# EAGLE design GeneralIOMiniRev3 (EAGLE 4.13)
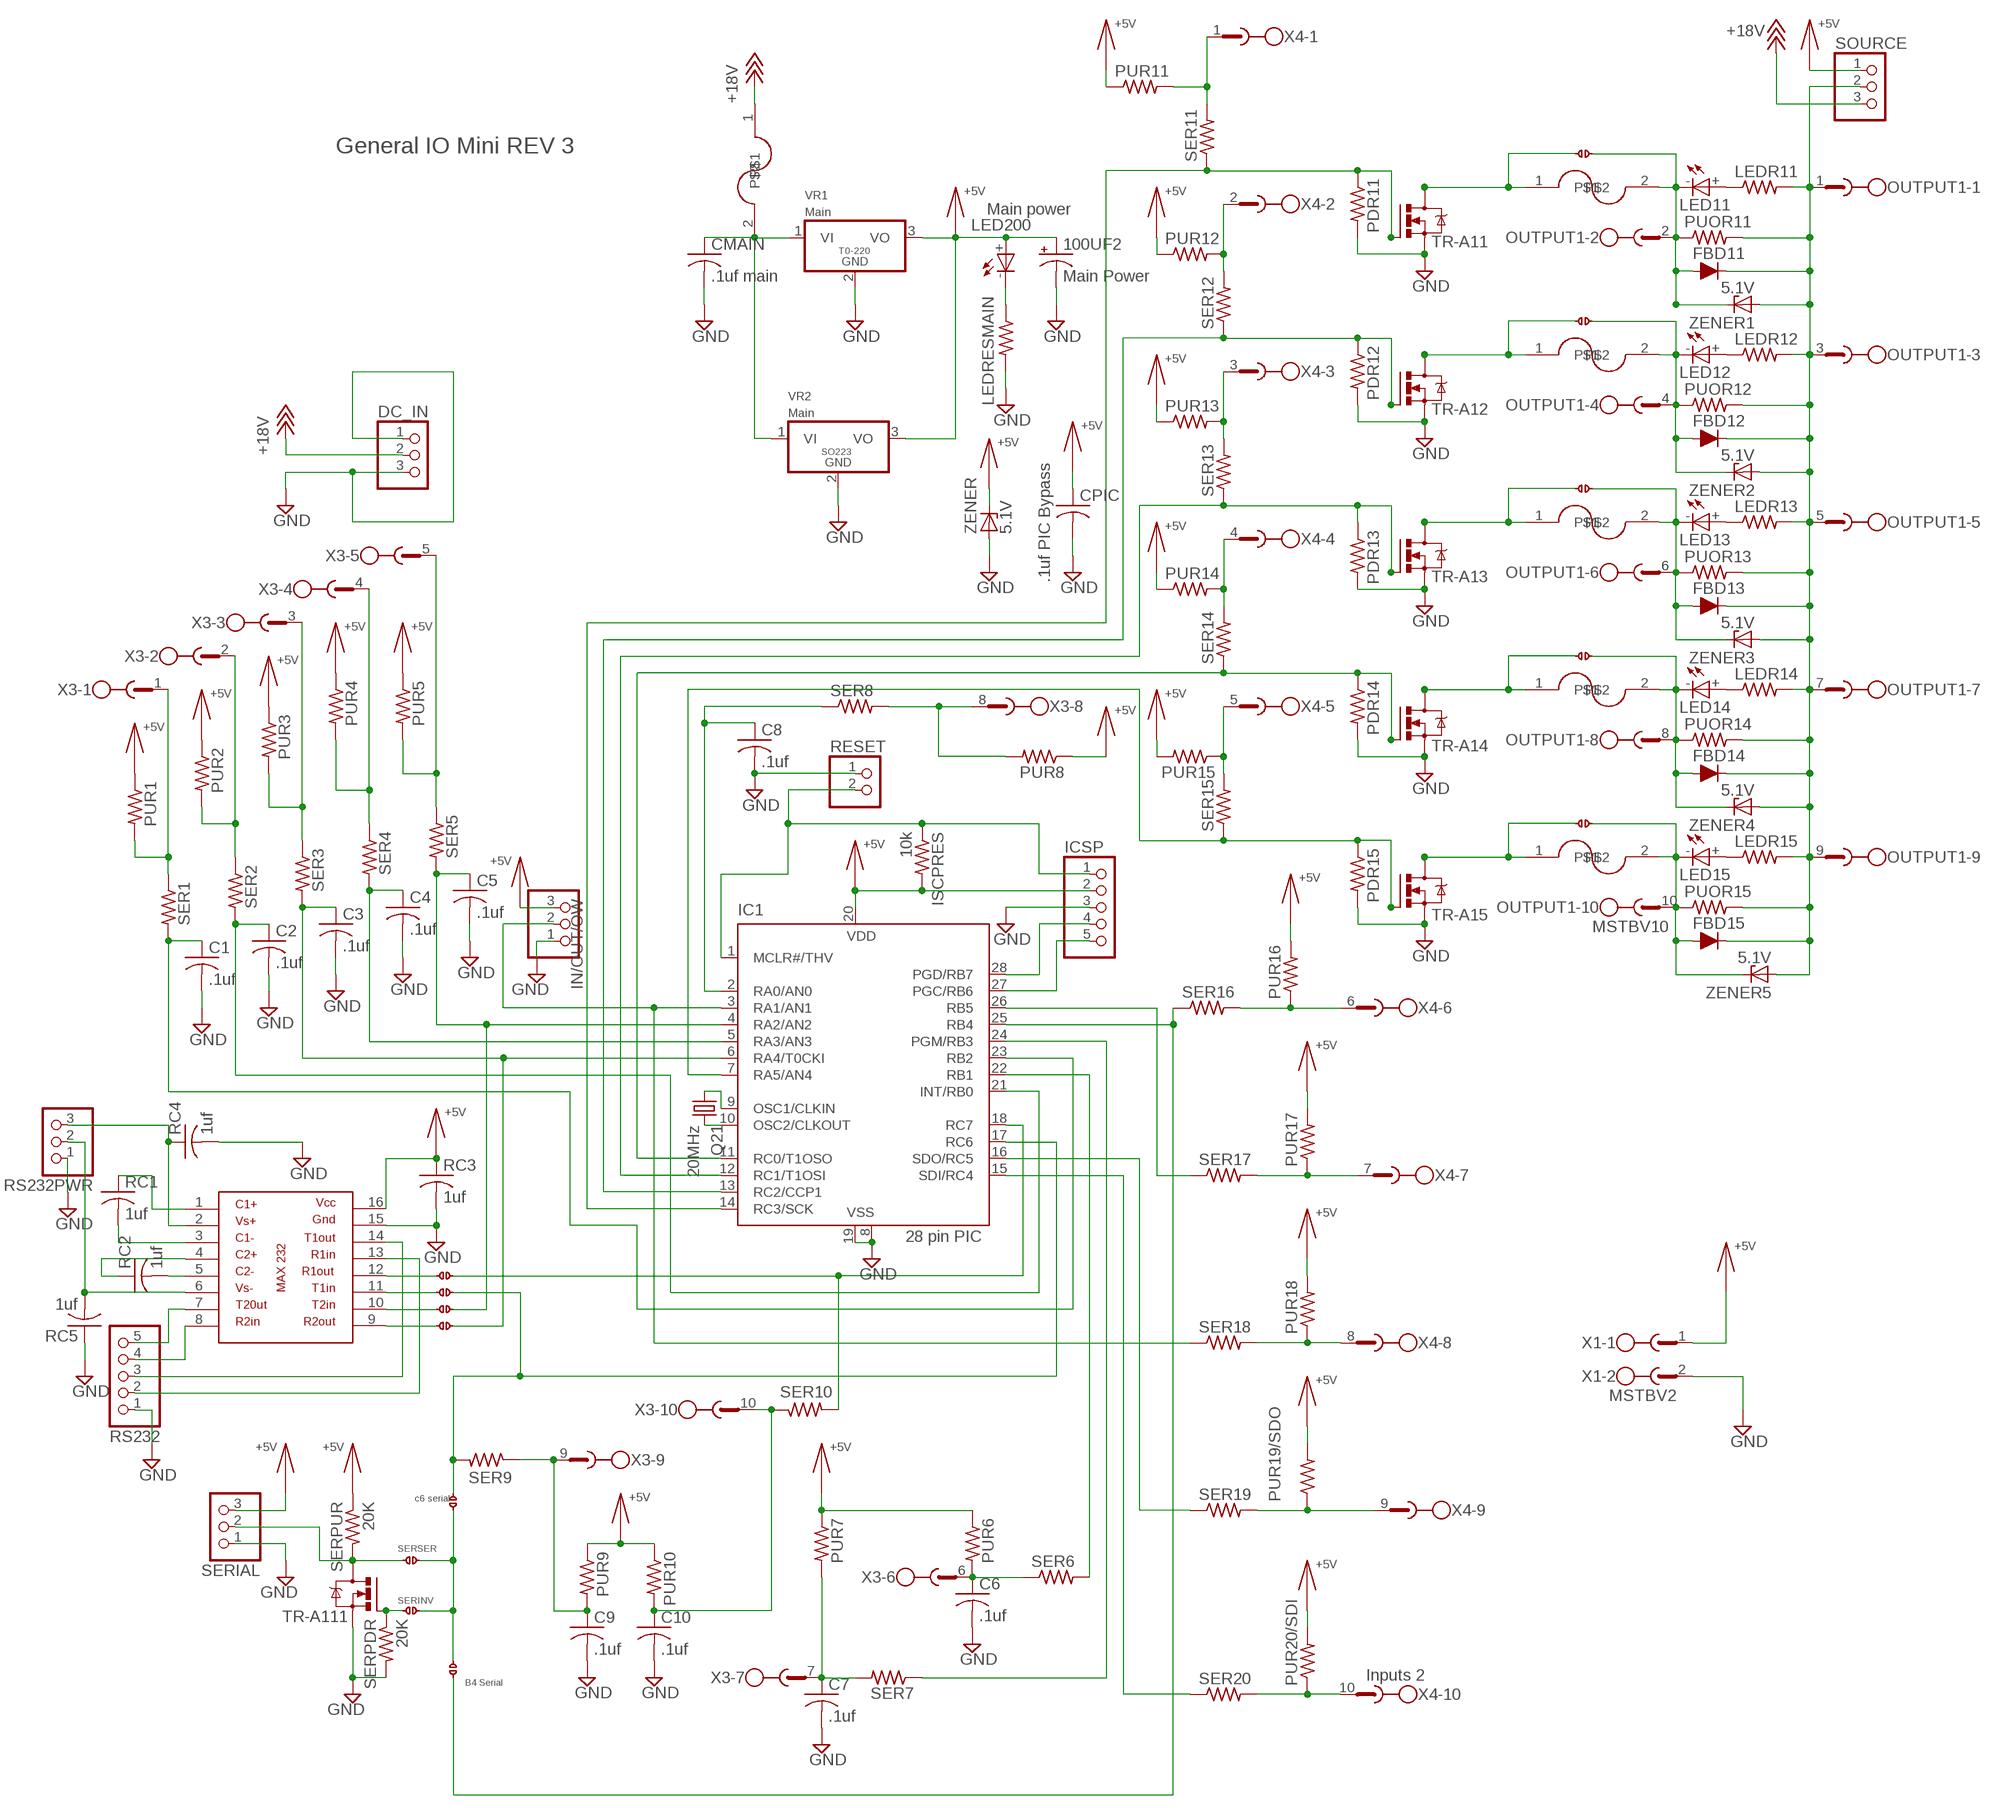
[diagram p0: schematic, sheet 1]

## Parts
100UF2  Main Power  CAPACITOR-ELECTROLYTICG  [PANASONIC_G]
B4SERIAL  SPLIT_PAD  [SPLIT_PAD]
C1  .1uf  CAPACITOR-NO-POLARITYC1210  [C1210]
C2  .1uf  CAPACITOR-NO-POLARITYC1210  [C1210]
C3  .1uf  CAPACITOR-NO-POLARITYC1210  [C1210]
C4  .1uf  CAPACITOR-NO-POLARITYC1210  [C1210]
C5  .1uf  CAPACITOR-NO-POLARITYC1210  [C1210]
C6  .1uf  CAPACITOR-NO-POLARITYC1210  [C1210]
C6SERIAL  SPLIT_PAD  [SPLIT_PAD]
C7  .1uf  CAPACITOR-NO-POLARITYC1210  [C1210]
C8  .1uf  CAPACITOR-NO-POLARITYC1210  [C1210]
C9  .1uf  CAPACITOR-NO-POLARITYC1210  [C1210]
C10  .1uf  CAPACITOR-NO-POLARITYC1210  [C1210]
CMAIN  .1uf main  CAPACITOR-NO-POLARITYC1210  [C1210]
CPIC  .1uf PIC Bypass  CAPACITOR-NO-POLARITYC1210  [C1210]
DC_IN  PINHD-1X3  [1X03]
FBD11  D-FILL-SOD-87  [SOD87]
FBD12  D-FILL-SOD-87  [SOD87]
FBD13  D-FILL-SOD-87  [SOD87]
FBD14  D-FILL-SOD-87  [SOD87]
FBD15  D-FILL-SOD-87  [SOD87]
IC1  28 pin PIC  PIC16F876SO  [SO-28W]
ICSP  PINHD-1X5  [1X05]
IN/OUT/OW  PINHD-1X3  [1X03]
ISCPRES  10k  RESISITORM1406  [M1406]
LED11  LED  [1206]
LED12  LED  [1206]
LED13  LED  [1206]
LED14  LED  [1206]
LED15  LED  [1206]
LED200  Main power  LED  [1206]
LEDR11  RESISITORM1406  [M1406]
LEDR12  RESISITORM1406  [M1406]
LEDR13  RESISITORM1406  [M1406]
LEDR14  RESISITORM1406  [M1406]
LEDR15  RESISITORM1406  [M1406]
LEDRESMAIN  RESISITORR1210  [R1210]
OUTPUT1  MSTBV10  [MSTBV10]
PDR11  RESISITORM1406  [M1406]
PDR12  RESISITORM1406  [M1406]
PDR13  RESISITORM1406  [M1406]
PDR14  RESISITORM1406  [M1406]
PDR15  RESISITORM1406  [M1406]
POLYFUSE11  POLYFUSE  [0204/5]
POLYFUSE12  POLYFUSE  [0204/5]
POLYFUSE13  POLYFUSE  [0204/5]
POLYFUSE14  POLYFUSE  [0204/5]
POLYFUSE15  POLYFUSE  [0204/5]
POLYFUSE200  Main power  POLYFUSE  [0204/5]
PUOR11  RESISITORM1406  [M1406]
PUOR12  RESISITORM1406  [M1406]
PUOR13  RESISITORM1406  [M1406]
PUOR14  RESISITORM1406  [M1406]
PUOR15  RESISITORM1406  [M1406]
PUR1  RESISITORM1406  [M1406]
PUR2  RESISITORM1406  [M1406]
PUR3  RESISITORM1406  [M1406]
PUR4  RESISITORM1406  [M1406]
PUR5  RESISITORM1406  [M1406]
PUR6  RESISITORM1406  [M1406]
PUR7  RESISITORM1406  [M1406]
PUR8  RESISITORM1406  [M1406]
PUR9  RESISITORM1406  [M1406]
PUR10  RESISITORM1406  [M1406]
PUR11  RESISITORM1406  [M1406]
PUR12  RESISITORM1406  [M1406]
PUR13  RESISITORM1406  [M1406]
PUR14  RESISITORM1406  [M1406]
PUR15  RESISITORM1406  [M1406]
PUR16  RESISITORM1406  [M1406]
PUR17  RESISITORM1406  [M1406]
PUR18  RESISITORM1406  [M1406]
PUR19/SDO  RESISITORM1406  [M1406]
PUR20/SDI  RESISITORM1406  [M1406]
Q21  20MHz  CRYSTALSM49  [SM49]
R1OUT  SPLIT_PAD  [SPLIT_PAD]
RC1  1uf  CAPACITOR-NO-POLARITYC1210  [C1210]
RC2  1uf  CAPACITOR-NO-POLARITYC1210  [C1210]
RC3  1uf  CAPACITOR-NO-POLARITYC1210  [C1210]
RC4  1uf  CAPACITOR-NO-POLARITYC1210  [C1210]
RC5  1uf  CAPACITOR-NO-POLARITYC1210  [C1210]
RESET  PINHD-1X2  [1X02]
RS232  PINHD-1X5  [1X05]
RS232PWR  PINHD-1X3  [1X03]
SER1  RESISITORM1406  [M1406]
SER2  RESISITORM1406  [M1406]
SER3  RESISITORM1406  [M1406]
SER4  RESISITORM1406  [M1406]
SER5  RESISITORM1406  [M1406]
SER6  RESISITORM1406  [M1406]
SER7  RESISITORM1406  [M1406]
SER8  RESISITORM1406  [M1406]
SER9  RESISITORM1406  [M1406]
SER10  RESISITORM1406  [M1406]
SER11  RESISITORM1406  [M1406]
SER12  RESISITORM1406  [M1406]
SER13  RESISITORM1406  [M1406]
SER14  RESISITORM1406  [M1406]
SER15  RESISITORM1406  [M1406]
SER16  RESISITORM1406  [M1406]
SER17  RESISITORM1406  [M1406]
SER18  RESISITORM1406  [M1406]
SER19  RESISITORM1406  [M1406]
SER20  RESISITORM1406  [M1406]
SERIAL  PINHD-1X3  [1X03]
SERIAL_INVERT  SPLIT_PAD  [SPLIT_PAD]
SERPDR  20K  RESISITORM1406  [M1406]
SERPUR  20K  RESISITORM1406  [M1406]
SERSER  SPLIT_PAD  [SPLIT_PAD]
SOURCE  PINHD-1X3  [1X03]
T1IN  SPLIT_PAD  [SPLIT_PAD]
T1IN1  SPLIT_PAD  [SPLIT_PAD]
T1IN2  SPLIT_PAD  [SPLIT_PAD]
TR-A11  ZXMN10A08GSOT223  [SOT223R_INFINEON]
TR-A12  ZXMN10A08GSOT223  [SOT223R_INFINEON]
TR-A13  ZXMN10A08GSOT223  [SOT223R_INFINEON]
TR-A14  ZXMN10A08GSOT223  [SOT223R_INFINEON]
TR-A15  ZXMN10A08GSOT223  [SOT223R_INFINEON]
TR-A111  ZXMN10A08GSOT223  [SOT223R_INFINEON]
U$1  MAX232  [SO16]
U$4  SPLIT_PAD  [SPLIT_PAD]
U$5  SPLIT_PAD  [SPLIT_PAD]
U$6  SPLIT_PAD  [SPLIT_PAD]
U$7  SPLIT_PAD  [SPLIT_PAD]
U$8  SPLIT_PAD  [SPLIT_PAD]
VR1  Main  VOLTAGE-REGULATOR  [TO220S]
VR2  Main  VOLTAGE-REGULATORSO-223  [SOT223R_INFINEON]
X1  MSTBV2  [MSTBV2]
X3  MSTBV10  [MSTBV10]
X4  Inputs 2  MSTBV10  [MSTBV10]
ZENER  5.1V  ZENER-DIODESMB  [SMB]
ZENER1  5.1V  ZENER-DIODESMB  [SMB]
ZENER2  5.1V  ZENER-DIODESMB  [SMB]
ZENER3  5.1V  ZENER-DIODESMB  [SMB]
ZENER4  5.1V  ZENER-DIODESMB  [SMB]
ZENER5  5.1V  ZENER-DIODESMB  [SMB]

## Nets
$N199: IC1.15(SDI/RC4) SER20.1
+5V: 100UF2.+ CPIC.1 IC1.20(VDD) ICSP.2 IN/OUT/OW.3 ISCPRES.2 LED200.+ PUR1.1 PUR2.1 PUR3.1 PUR4.1 PUR5.1 PUR6.1 PUR7.1 PUR8.1 PUR9.1 PUR10.1 PUR11.1 PUR12.1 PUR13.1 PUR14.1 PUR15.2 PUR16.2 PUR17.2 PUR18.2 PUR19/SDO.2 PUR20/SDI.2 RC3.1 SERIAL.3 SERPUR.1 SOURCE.1 U$1.16 VR1.3(VO) VR2.3(VO) X1.1 ZENER.C
+18V: DC_IN.2 POLYFUSE200.1 SOURCE.3
GND: 100UF2.- C1.2 C2.2 C3.2 C4.2 C5.2 C6.2 C7.2 C8.2 C9.2 C10.2 CMAIN.2 CPIC.2 DC_IN.1 DC_IN.3 IC1.8(VSS) IC1.19(VSS) ICSP.3 IN/OUT/OW.1 LEDRESMAIN.2 PDR11.2 PDR12.2 PDR13.2 PDR14.2 PDR15.2 RC3.2 RC4.2 RC5.1 RESET.1 RS232.1 RS232PWR.1 SERIAL.1 SERPDR.2 TR-A11.3(S) TR-A12.3(S) TR-A13.3(S) TR-A14.3(S) TR-A15.3(S) TR-A111.3(S) U$1.15 VR1.2(GND) VR2.2(GND) X1.2 ZENER.A
N$1: PUR20/SDI.1 SER20.2 X4.10
N$2: T1IN.P$2 U$1.11
N$3: PUR17.1 SER17.2 X4.7
N$4: R1OUT.P$2 U$1.12
N$5: T1IN1.P$2 U$1.10
N$6: T1IN2.P$2 U$1.9
N$7: C1.1 IC1.23(RB2) SER1.2
N$8: IC1.26(RB5) SER17.1
N$9: C2.1 IC1.21(INT/RB0) SER2.2
N$11: IC1.16(SDO/RC5) SER19.1
N$12: C8.1 IC1.2(RA0/AN0) SER8.1
N$13: IC1.13(RC2/CCP1) PDR12.1 SER12.1 TR-A12.1(G)
N$14: IC1.12(RC1/T1OSI) PDR13.1 SER13.1 TR-A13.1(G)
N$15: IC1.11(RC0/T1OSO) PDR14.1 SER14.1 TR-A14.1(G)
N$16: FBD12.2(A) LED12.- OUTPUT1.4 POLYFUSE12.2 PUOR12.1 U$5.P$1 ZENER2.C
N$17: POLYFUSE15.1 TR-A15.2(D) U$8.P$2
N$18: FBD15.2(A) LED15.- OUTPUT1.10 POLYFUSE15.2 PUOR15.1 U$8.P$1 ZENER5.C
N$19: RS232.5 U$1.7
N$20: PUR16.1 SER16.2 X4.6
N$21: POLYFUSE14.1 TR-A14.2(D) U$7.P$2
N$22: FBD14.2(A) LED14.- OUTPUT1.8 POLYFUSE14.2 PUOR14.1 U$7.P$1 ZENER4.C
N$23: POLYFUSE13.1 TR-A13.2(D) U$6.P$2
N$24: FBD13.2(A) LED13.- OUTPUT1.6 POLYFUSE13.2 PUOR13.1 U$6.P$1 ZENER3.C
N$25: PUR14.2 SER14.2 X4.4
N$26: PUR12.2 SER12.2 X4.2
N$27: POLYFUSE12.1 TR-A12.2(D) U$5.P$2
N$28: PUR13.2 SER13.2 X4.3
N$29: POLYFUSE11.1 TR-A11.2(D) U$4.P$2
N$30: FBD11.2(A) LED11.- OUTPUT1.2 POLYFUSE11.2 PUOR11.1 U$4.P$1 ZENER1.C
N$31: IC1.28(PGD/RB7) ICSP.4
N$32: PUR15.1 SER15.2 X4.5
N$33: IC1.7(RA5/AN4) PDR15.1 SER15.1 TR-A15.1(G)
N$34: C3.1 IC1.6(RA4/T0CKI) SER3.2 T1IN2.P$1
N$35: IC1.10(OSC2/CLKOUT) Q21.2
N$36: SERIAL_INVERT.P$2 SERPDR.1 TR-A111.1(G)
N$37: IC1.1(MCLR#/THV) ICSP.1 ISCPRES.1 RESET.2
N$38: SERIAL.2 SERPUR.2 SERSER.P$2 TR-A111.2(D)
N$39: IC1.9(OSC1/CLKIN) Q21.1
N$40: IC1.27(PGC/RB6) ICSP.5
N$41: IC1.18(RC7) R1OUT.P$1 SER10.2
N$42: C9.1 PUR9.2 SER9.1 X3.9
N$43: C5.1 IC1.4(RA2/AN2) SER5.2 T1IN1.P$1
N$44: C6SERIAL.P$1 IC1.17(RC6) SER9.2 T1IN.P$1
N$45: RS232.4 U$1.8
N$49: RS232.3 U$1.14
N$52: FBD11.1(C) FBD12.1(C) FBD13.1(C) FBD14.1(C) FBD15.1(C) LEDR11.2 LEDR12.2 LEDR13.2 LEDR14.2 LEDR15.2 OUTPUT1.1 OUTPUT1.3 OUTPUT1.5 OUTPUT1.7 OUTPUT1.9 PUOR11.2 PUOR12.2 PUOR13.2 PUOR14.2 PUOR15.2 SOURCE.2 ZENER1.A ZENER2.A ZENER3.A ZENER4.A ZENER5.A
N$55: LED200.- LEDRESMAIN.1
N$60: RS232.2 U$1.13
N$63: CMAIN.1 POLYFUSE200.2 VR1.1(VI) VR2.1(VI)
N$71: LED15.+ LEDR15.1
N$72: LED14.+ LEDR14.1
N$73: LED13.+ LEDR13.1
N$74: LED12.+ LEDR12.1
N$75: LED11.+ LEDR11.1
N$77: PUR3.2 SER3.1 X3.3
N$80: RC2.2 U$1.5
N$81: RC1.2 U$1.3
N$82: RC2.1 U$1.4
N$83: RC1.1 U$1.1
N$84: RC4.1 RS232PWR.3 U$1.2
N$85: RC5.2 RS232PWR.2 U$1.6
N$86: PUR4.2 SER4.1 X3.4
N$87: PUR5.2 SER5.1 X3.5
N$88: PUR8.2 SER8.2 X3.8
N$89: PUR1.2 SER1.1 X3.1
N$90: IC1.14(RC3/SCK) PDR11.1 SER11.1 TR-A11.1(G)
N$91: PUR2.2 SER2.1 X3.2
N$92: PUR11.2 SER11.2 X4.1
N$95: C4.1 IC1.5(RA3/AN3) SER4.2
N$99: B4SERIAL.P$2 IC1.25(RB4) SER16.1
N$100: PUR19/SDO.1 SER19.2 X4.9
N$102: PUR18.1 SER18.2 X4.8
N$104: B4SERIAL.P$1 C6SERIAL.P$2 SERIAL_INVERT.P$1 SERSER.P$1
N$106: C6.1 PUR6.2 SER6.1 X3.6
N$107: IC1.22(RB1) SER6.2
N$108: C7.1 PUR7.2 SER7.2 X3.7
N$109: C10.1 PUR10.2 SER10.1 X3.10
N$111: IC1.24(PGM/RB3) SER7.1
SER18: IC1.3(RA1/AN1) IN/OUT/OW.2 SER18.1

## Notes on the sheet
- General IO Mini REV 3
- T0-220
- SO223
- c6 serial
- SERSER
- SERINV
- B4 Serial

## Library data of the parts
100UF2 = 1 Dan's Common Parts:CAPACITOR-ELECTROLYTIC: POLARIZED CAPACITOR, American symbol
B4SERIAL C6SERIAL R1OUT SERIAL_INVERT SERSER T1IN T1IN1 T1IN2 U$4-U$8 = 1 Dan's Common Parts:SPLIT_PAD
C1-C10 CMAIN CPIC RC1-RC5 = 1 Dan's Common Parts:CAPACITOR-NO-POLARITY: CAPACITOR, American symbol
DC_IN IN/OUT/OW RS232PWR SERIAL SOURCE = pinhead:PINHD-1X3: PIN HEADER
FBD11-FBD15 = semicon-smd-ipc:D-FILL-: DIODE filled
IC1 = 1 Dan's Common Parts:PIC16*876: MICROCONTROLLER flash type
ICSP RS232 = pinhead:PINHD-1X5: PIN HEADER
ISCPRES LEDR11-LEDR15 LEDRESMAIN PDR11-PDR15 PUOR11-PUOR15 PUR1-PUR18 PUR19/SDO PUR20/SDI SER1-SER20 SERPDR SERPUR = 1 Dan's Common Parts:RESISITOR: RESISTOR, American symbol
LED11-LED15 LED200 = 1 Dan's Common Parts:LED
OUTPUT1 X3 X4 = con-phoenix-508:MSTBV10: PHOENIX
POLYFUSE11-POLYFUSE15 POLYFUSE200 = 1 Dan's Common Parts:POLYFUSE
Q21 = 1 Dan's Common Parts:CRYSTAL: CRYSTAL
RESET = pinhead:PINHD-1X2: PIN HEADER
TR-A11-TR-A15 TR-A111 = 1 Dan's Common Parts:ZXMN10A08G: N-CHANNEL MOS FET
U$1 = 1 Dan's Common Parts:MAX232
VR1 VR2 = 1 Dan's Common Parts:VOLTAGE-REGULATOR: Positive VOLTAGE REGULATOR Source: http://cache.national.com/ds/LM/LM78L05.pdf http://www.fairchildsemi.com/ds/LM/LM7805.pdf
X1 = con-phoenix-508:MSTBV2: PHOENIX
ZENER ZENER1-ZENER5 = 1 Dan's Common Parts:ZENER-DIODE: Z-Diode

## Board
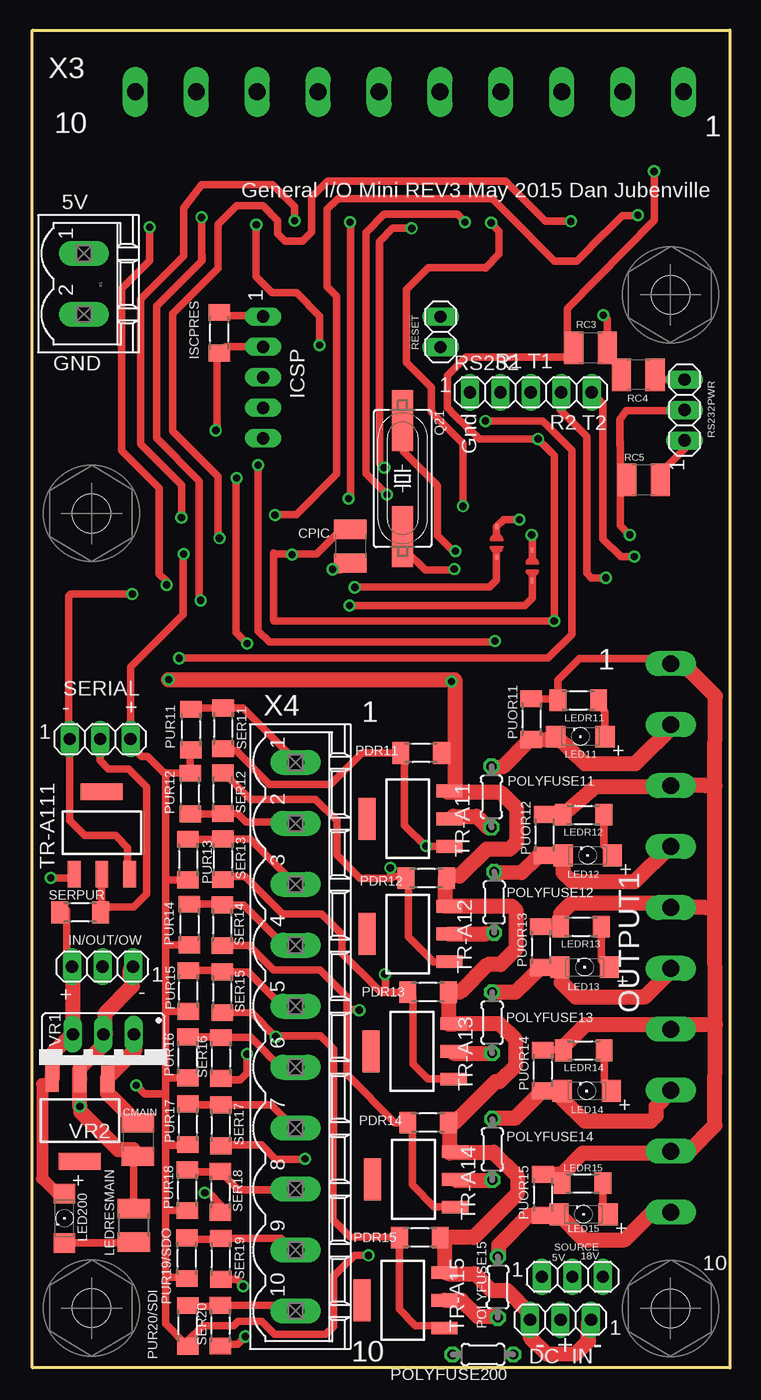
[diagram p1: board, top side]
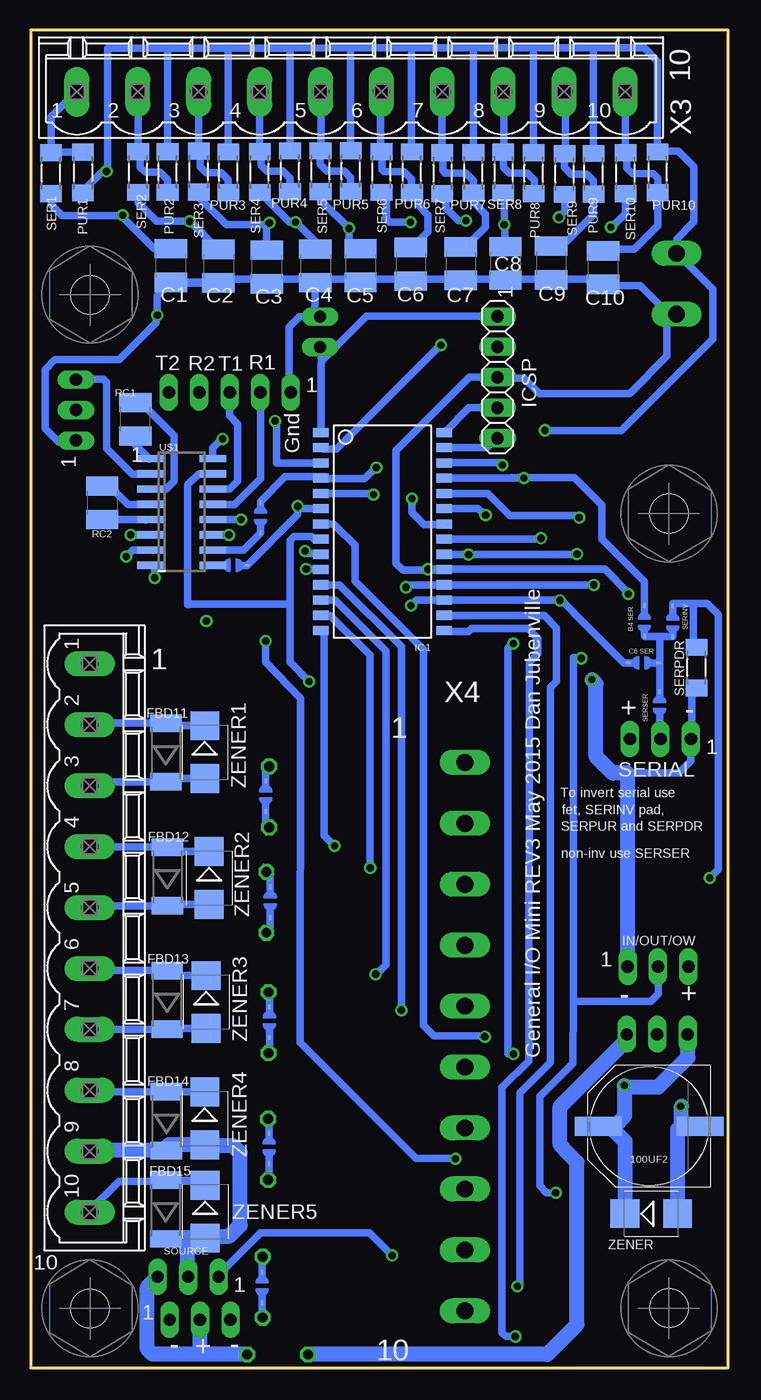
[diagram p2: board, bottom side, seen from below]

Size 58.17 x 111.53 mm. Coordinates in mm from the lower left corner, seen from the top.
Outline: 0,111.53 58.17,111.53 58.17,0 0,0 0,111.53
Copper layers (1*16): Top 0.035mm / dielectric 1.5mm / Bottom 0.035mm
Design rules "default": minimum track width 5mil, minimum drill 20mil, track to track 15mil, track to pad 15mil, pad to pad 15mil, via to via 15mil, smd to smd 0mil, copper to edge 5mil, drill to drill 5mil, minimum pad ring 10mil, minimum via ring 8mil, stop-mask expansion 4mil, vias tented up to drill 0mil, thermal gap 10mil

### Footprints (pad centres in the part's own frame; a part is rotated, then mirrored left to right if it is on the bottom)
PANASONIC_G = smd 3.9 x 1.6: + 4.25,0; - -4.25,0
SPLIT_PAD = smd 0.406 x 0.203: P$1 0,0; P$2 2.54,0
C1210 = smd 1.6 x 2.7: 1 -1.4,0; 2 1.4,0
1X03 = drill 1.016 long: 1 -2.54,0; 2 0,0; 3 2.54,0
SOD87 = smd 1.45 x 2.6: 1 -2.445,0; 2 2.445,0
SO-28W = smd 0.762 x 1.27: 1 -7.62,-5.207; 2 -6.35,-5.207; 3 -5.08,-5.207; 4 -3.81,-5.207; 5 -2.54,-5.207; 6 -1.27,-5.207; 7 0,-5.207; 8 1.27,-5.207; 9 2.54,-5.207; 10 3.81,-5.207; 11 5.08,-5.207; 12 6.35,-5.207; 13 7.62,-5.207; 14 8.89,-5.207; 15 8.89,5.08; 16 7.62,5.08; 17 6.35,5.08; 18 5.08,5.08; 19 3.81,5.08; 20 2.54,5.08; 21 1.27,5.08; 22 0,5.08; 23 -1.27,5.08; 24 -2.54,5.08; 25 -3.81,5.08; 26 -5.08,5.08; 27 -6.35,5.08; 28 -7.62,5.08
1X05 = drill 1.016 long: 1 -5.08,0; 2 -2.54,0; 3 0,0; 4 2.54,0; 5 5.08,0
M1406 = smd 1.4 x 1.8: 1 -1.7,0; 2 1.7,0
1206 = smd 1.6 x 1.803: + -1.422,0; - 2.692,0
R1210 = smd 1.6 x 2.7: 1 -1.4,0; 2 1.4,0
MSTBV10 = drill 1.397 long: 1 -22.86,0; 2 -17.78,0; 3 -12.7,0; 4 -7.62,0; 5 -2.54,0; 6 2.54,0; 7 7.62,0; 8 12.7,0; 9 17.78,0; 10 22.86,0
0204/5 = drill 0.813 octagon: 1 -2.54,0; 2 2.54,0
SM49 = smd 5.08 x 1.778: 1 -4.826,0; 2 4.826,0
1X02 = drill 1.016 long: 1 -1.27,0; 2 1.27,0
SOT223R_INFINEON = smd 1.067 x 2.184: 1 -2.311,-3.479; 2 0,-3.48; 3 2.312,-3.48 | smd 3.5 x 1.4: 4 0,3.404
SO16 = smd 0.6 x 2.2: 1 -4.445,-2.6; 2 -3.175,-2.6; 3 -1.905,-2.6; 4 -0.635,-2.6; 5 0.635,-2.6; 6 1.905,-2.6; 7 3.175,-2.6; 8 4.445,-2.6; 9 4.445,2.6; 10 3.175,2.6; 11 1.905,2.6; 12 0.635,2.6; 13 -0.635,2.6; 14 -1.905,2.6; 15 -3.175,2.6; 16 -4.445,2.6
SCREW = hole 3.2: 0,0
TO220S = drill 1.016 long: 1 -2.54,-2.54; 2 0,-2.54; 3 2.54,-2.54
MSTBV2 = drill 1.397 long: 1 -2.54,0; 2 2.54,0
SMB = smd 2.4 x 2.4: A 2.2,0; C -2.2,0

### Placement (x,y rotation side)
100UF2  6.58,20.14 180 bottom
B4SERIAL  6.99,61.01 90 bottom
C1  46.48,91.9 270 bottom
C2  42.49,91.85 270 bottom
C3  38.48,91.77 270 bottom
C4  34.42,91.87 270 bottom
C5  30.66,91.9 270 bottom
C6  26.47,92 270 bottom
C6SERIAL  8.33,58.78 0 bottom
C7  22.3,92.05 270 bottom
C8  18.57,92.08 270 bottom
C9  14.76,92.1 270 bottom
C10  10.44,91.72 270 bottom
CMAIN  8.81,19.02 270 top
CPIC  26.52,68.5 270 top
DC_IN  44.04,4.01 180 top
FBD11  46.89,51.31 90 bottom
FBD12  46.76,40.97 90 bottom
FBD13  46.79,30.68 90 bottom
FBD14  46.84,20.57 90 bottom
FBD15  46.91,13.21 90 bottom
IC1  28.75,70.36 270 bottom
ICSP  19.23,82.58 270 bottom
IN/OUT/OW  5.84,33.45 180 top
ISCPRES  15.6,86.28 270 top
LED11  46.33,52.63 180 top
LED12  46.94,42.72 180 top
LED13  46.69,33.4 180 top
LED14  46.86,23.09 180 top
LED15  46.58,12.8 180 top
LED200  2.67,13.11 270 top
LEDR11  45.52,55.65 180 top
LEDR12  45.95,46.1 180 top
LEDR13  45.75,36.78 180 top
LEDR14  45.97,26.47 180 top
LEDR15  45.87,15.39 180 top
LEDRESMAIN  8.46,11.89 90 top
OUTPUT1  53.24,35.84 270 bottom
PDR11  32.41,51.26 0 top
PDR12  32.84,40.82 0 top
PDR13  32.99,31.32 0 top
PDR14  32.99,20.45 0 top
PDR15  32.31,10.87 0 top
POLYFUSE11  38.28,47.6 90 top
POLYFUSE12  38.51,38.81 90 top
POLYFUSE13  38.33,28.78 90 top
POLYFUSE14  38.35,18.21 90 top
POLYFUSE15  38.81,6.73 90 top
POLYFUSE200  37.57,1.12 180 top
PUOR11  41.61,54.08 90 top
PUOR12  42.7,44.42 90 top
PUOR13  42.39,35.08 90 top
PUOR14  42.54,24.79 90 top
PUOR15  42.57,14.43 90 top
PUR1  53.8,99.64 90 bottom
PUR2  46.74,99.7 270 bottom
PUR3  41.68,99.67 270 bottom
PUR4  36.53,99.75 270 bottom
PUR5  31.47,99.77 270 bottom
PUR6  26.37,99.67 270 bottom
PUR7  21.23,99.62 270 bottom
PUR8  16.21,99.59 270 bottom
PUR9  11.23,99.54 270 bottom
PUR10  5.87,99.67 270 bottom
PUR11  13.21,53.21 90 top
PUR12  13.16,47.88 270 top
PUR13  12.98,42.37 90 top
PUR14  13.08,36.96 90 top
PUR15  13,31.42 270 top
PUR16  12.95,25.88 270 top
PUR17  12.98,20.32 270 top
PUR18  12.93,14.81 270 top
PUR19/SDO  12.88,9.14 270 top
PUR20/SDI  12.95,3.51 270 top
Q21  30.86,74.14 270 top
R1OUT  38.71,67.59 90 top
RC1  49.43,79.07 90 bottom
RC2  52.2,72.11 270 bottom
RC3  46.53,85.04 0 top
RC4  50.52,82.78 180 top
RC5  50.95,74.02 180 top
RESET  34.04,86.36 270 top
RS232  41.55,81.33 0 top
RS232PWR  54.38,79.86 90 top
SER1  56.46,99.59 270 bottom
SER2  49.2,99.7 270 bottom
SER3  44.15,99.72 270 bottom
SER4  39.07,99.7 270 bottom
SER5  33.99,99.75 270 bottom
SER6  28.91,99.7 270 bottom
SER7  23.83,99.59 90 bottom
SER8  18.75,99.64 90 bottom
SER9  13.64,99.52 270 bottom
SER10  8.56,99.59 270 bottom
SER11  15.9,53.31 90 top
SER12  15.87,47.9 270 top
SER13  15.87,42.39 90 top
SER14  15.82,36.91 90 top
SER15  15.82,31.32 90 top
SER16  15.72,25.83 90 top
SER17  15.7,20.22 90 top
SER18  15.67,14.68 90 top
SER19  15.7,9.09 90 top
SER20  15.67,3.53 90 top
SERIAL  5.64,52.43 0 top
SERIAL_INVERT  4.62,60.96 90 bottom
SERPDR  2.64,58.37 270 bottom
SERPUR  3.99,37.97 0 top
SERSER  5.71,56.36 270 bottom
SOURCE  45.03,7.59 0 top
T1IN  41.68,65.63 90 top
T1IN1  38.99,72.14 270 bottom
T1IN2  40.13,66.9 180 bottom
TR-A11  31.29,45.77 90 top
TR-A12  31.29,36.17 90 top
TR-A13  31.65,26.39 90 top
TR-A14  31.78,15.72 90 top
TR-A15  30.89,5.64 90 top
TR-A111  5.79,44.63 0 top
U$1  45.57,71.35 270 bottom
U$4  38.56,48.92 270 bottom
U$5  38.18,40.08 270 bottom
U$6  38.25,30.07 270 bottom
U$7  38.28,19.56 270 bottom
U$8  38.86,7.98 270 bottom
U$11  [SCREW]  4.93,4.98 0 top
U$13  [SCREW]  4.93,71.22 0 top
U$14  [SCREW]  53.21,4.95 0 top
U$15  [SCREW]  53.21,89.46 0 top
VR1  5.92,25.27 180 top
VR2  3.96,20.62 180 top
X1  4.29,90.37 270 top
X3  31.45,106.38 0 bottom
X4  21.95,27.61 270 top
ZENER  6.41,12.86 0 bottom
ZENER1  43.64,51.33 270 bottom
ZENER2  43.28,40.84 270 bottom
ZENER3  43.54,30.51 270 bottom
ZENER4  43.64,20.8 270 bottom
ZENER5  43.61,13.03 270 bottom

### Tracks (layer width: path | path; a pad name or v marks a point on that pad's centre or on a via)
$N199  (via drill 0.6)
  Top 0.61: 15.75,1.88 15.7,1.83 SER20.1 15.72,1.88 15.72,1.96 17.09,1.96 v17.76,2.62
  Bottom 0.61: 23.8,61.47 23.83,61.49 | 23.8,61.47 IC1.15 | 23.8,61.47 23.7,61.37 21.67,61.37 21.41,61.62 16.66,61.62 15.85,60.81 15.85,59.56 16.56,58.85 16.61,25.6 18.85,23.37 18.85,2.95 18.52,2.62 v17.76,2.62
+5V  (via drill 0.6)
  Top 0.61: CPIC.1 25.73,69.9 23.67,67.84 21.69,67.84 v21.64,67.79 21.64,67.84 20.17,67.84 20.09,67.92 20.09,62.33 20.17,62.25 v43.51,62.25 43.54,62.25 43.54,76.05 42.14,77.45 | SERPUR.1 2.67,38.2 2.84,38.15 2.84,33.78 3.23,33.4 | 3.23,33.4 3.28,33.45 IN/OUT/OW.3 | v51.84,99.75 51.84,95.68 44.59,88.3 44.59,86.19 45.13,85.68 RC3.1 45.24,85.04 | SERIAL.3 8.23,52.43 8.2,54.43 | 8.2,54.43 8.2,51.92 9.09,50.98 9.6,50.98 11.2,49.38 11.1,49.38 | 11.1,5.71 11.1,7.54 | 11.1,5.71 11.1,5.54 | 11.1,7.54 11.1,13.13 | 11.1,13.13 11.1,18.54 | 11.1,22.84 11.1,22.05 | 11.1,22.84 11.1,24.16 | 11.1,24.16 11.1,29.72 | 11.1,29.72 11.1,33.15 | 11.1,33.15 11.1,35.31 | 11.1,35.31 11.1,40.72 | 11.1,40.72 11.1,44.09 11.1,49.38 | 11.1,49.38 11.1,49.61 | 11.1,33.15 11.12,33.15 11.15,33.12 | 3.4,27.79 VR1.3 3.3,27.81 | 3.4,33.22 3.23,33.4 | 1.57,23.65 1.65,23.93 VR2.3 | 2.06,14.55 2.67,14.5 LED200.+ | 11.1,18.54 11.1,22.84 | 11.1,22.84 9.35,22.84 v8.66,23.55 | 45.24,85.04 45.29,85.09 | 39.27,84.25 44.45,84.25 45.24,85.04 | 39.27,84.25 39.27,84.23 39.29,84.25 | 37.06,84.25 39.27,84.25 | 37.06,84.25 36.98,84.25 | PUR20/SDI.2 11.1,3.66 11.1,5.71 | PUR19/SDO.2 12.78,7.54 11.1,7.54 | PUR18.2 12.9,13.13 11.1,13.13 | PUR17.2 12.9,18.54 11.1,18.54 | PUR16.2 11.13,24.18 11.1,24.16 | PUR15.2 11.1,29.72 | 11.1,35.31 11.12,35.31 11.17,35.26 PUR14.1 | 11.1,40.72 11.2,40.72 11.25,40.67 PUR13.1 | 11.1,49.61 11.07,49.63 | 11.1,49.61 11.13,49.58 PUR12.1 13.21,49.63 13.16,49.68 13.16,51.66 13.18,51.69 13.21,51.66 PUR11.1 | ICSP.2 16.13,85.12 ISCPRES.2 15.5,84.68 15.39,84.68 15.39,78.26 v15.29,78.16 | 8.2,54.43 8.2,58.45 12.57,62.81 12.57,67.84 v12.6,67.84
  Top 0.61: 42.14,77.45 37.29,77.45 35.25,79.4 34.62,80.04 34.62,82.73 36.14,84.25 37.06,84.25 | 42.14,77.45 v42.16,77.45 | v28.02,9.37 26.85,9.37 25.1,7.62 25.1,3.43 24.46,2.79 20.19,2.79 19.1,3.89 17.14,3.89 16.79,3.53 14.25,3.53 12.88,2.16 12.88,1.88 PUR20/SDI.2 | 12.72,1.88 12.8,1.8 PUR20/SDI.2 | PUR20/SDI.2 12.9,1.85 12.83,1.85 12.83,1.55
  Top 1.016: 1.57,23.65 0.81,23.65 0.81,15.8 2.06,14.55
  Top 1.27: 3.4,27.79 3.4,33.22 | VR2.3 1.65,26.16 3.3,27.81
  Bottom 0.61: 41.68,110.01 36.58,110.01 36.52,110.01 | 46.71,110.01 41.68,110.01 | 46.71,110.01 51.74,110.01 51.74,99.77 | 36.52,110.01 31.5,110.03 | 31.5,110.03 26.39,110.03 | 26.39,110.03 21.23,110.03 | 21.23,110.03 16.23,110.03 | 16.23,110.03 11.23,110.06 | 11.23,110.06 7.04,110.06 7.04,110.08 5.89,108.94 5.89,101.34 PUR10.1 6.02,101.37 6.04,101.4 5.99,101.45 4.17,101.45 2.84,100.13 2.84,95.56 4.29,94.11 X1.1 1.29,89.92 1.29,85.75 8.89,78.16 v15.29,78.16 | 51.74,99.77 51.89,99.92 | PUR6.1 26.39,101.34 26.39,110.03 | 21.23,110.03 PUR7.1 | PUR8.1 16.23,101.27 16.23,110.03 | 11.23,101.12 PUR9.1 11.23,110.06 | IC1.20 23.65,67.82 23.62,67.79 v21.64,67.79 12.6,67.79 v12.6,67.84 | 51.74,99.77 51.84,99.67 v51.84,99.75 | 8.56,23.44 8.71,23.44 | 3.35,27.71 3.38,27.74 VR1.3 | 11.54,20.33 11.63,20.4 | 11.54,20.33 100UF2.+ 9.47,20.14 9.42,20.19 | 11.54,20.33 11.46,20.32 | 8.56,23.44 8.56,23.42 | v8.66,23.55 8.56,23.62 8.56,23.44 | 42.16,77.5 42.14,77.52 | v42.16,77.45 42.16,77.5 | U$1.16 42.97,76.69 42.16,77.5 | v51.84,99.75 51.82,99.72 | v51.84,99.75 51.84,99.64 52.3,99.64 53.92,98.02 53.85,97.94 PUR1.1 | ICSP.2 19.28,85.12 | 31.5,110.03 31.5,109.98 31.47,109.96 PUR5.1 | 36.52,110.01 PUR4.1 | 41.68,110.01 PUR3.1 | 46.71,110.01 46.71,109.98 46.74,109.96 PUR2.1 | SOURCE.1 42.49,7.75 38.99,11.25 29.9,11.25 v28.02,9.37
  Bottom 1.27: 3.35,27.71 3.35,25.88 5.82,23.42 8.53,23.42 8.56,23.44 | ZENER.C 8.61,18.9 9.98,20.27 11.46,20.32 | v8.66,23.55 8.64,23.55 8.64,20.98 9.42,20.19
+18V
  Bottom 1.27: DC_IN.2 44.02,4.04 43.99,4.04 44.04,3.91 44.04,1.14 | SOURCE.3 48.44,6.73 48.44,1.57 48.01,1.14 44.04,1.14 | POLYFUSE200.1 43.13,1.14 44.04,1.14
GND  (via drill 0.6)
  Top 0.61: 34.01,51.18 34.09,51.26 PDR11.2 34.06,51.26 | 8.1,41.07 8.15,41.02 | 8.1,41.07 TR-A111.3 | 8.1,41.07 7.95,41.22 7.95,43.36 6.93,44.37 4.34,44.37 3.1,45.62 SERIAL.1 3.1,52.32 3.07,52.3 3.02,52.35 3.02,64.34 3.2,64.52 v8.33,64.52 | 27.18,67.56 26.72,67.1 CPIC.2 26.52,67.08 26.04,66.6 25.65,66.52 24.89,66.52 v25.02,66.57 | PDR14.2 34.85,20.45 | TR-A13.3 34.92,28.5 | TR-A13.3 35.05,28.7 34.7,29.06 | TR-A13.3 35.28,28.85 | 34.47,40.82 34.44,40.84 | 34.47,40.82 PDR12.2 34.72,41 | 34.47,40.82 34.77,40.51 | 8.15,33.22 IN/OUT/OW.1 | 8.33,32.36 8.15,32.54 | 6.07,27.86 5.97,27.86 VR1.2 | LEDRESMAIN.2 8.46,17.55 8.64,17.73 8.74,17.62 CMAIN.2 8.89,17.62 8.94,17.68 8.41,18.21 | v3.96,21.79 3.79,21.62 4.06,21.29 | 34.9,57.38 34.9,57.23 v34.95,57.23 | v47.6,87.76 47.93,87.42 RC3.2 47.88,84.56 47.9,84.53 48.01,84.25 48.15,84.25 48.64,83.77 49.22,83.75 RC4.2 | 55.07,77.17 55.09,77.19 55.07,77.22 RS232PWR.1 55.07,77.32 52.35,74.6 RC5.1
  Top 1.27: 8.15,32.54 8.15,33.22 | 8.33,32.36 8.33,31.83 6.07,29.57 6.07,27.86 | v3.96,21.79 VR2.2 3.96,24.99 5.99,27.03 5.99,27.81 VR1.2 | 4.06,21.29 7.14,18.21 8.41,18.21 | v11.35,57.38 34.9,57.38 35.23,57.38 35.23,51.18 | 35,28.68 35.1,28.68 TR-A13.3 35.03,28.7 | 35,28.68 34.7,28.68 PDR13.2 35.64,31.32 37.95,33.63 39.04,33.63 40.34,34.92 40.34,38.12 39.95,38.51 34.75,38.51 | PDR12.2 34.52,40.84 34.42,40.84 34.42,38.84 TR-A12.3 34.75,38.51 | 34.75,38.51 34.42,38.51 | 34.72,41 35.61,41 37.85,43.23 39.78,43.23 40.36,43.81 40.36,46.66 39.01,48.01 34.7,48.01 | 34.7,48.01 34.62,48.01 | 34.7,48.01 TR-A11.3 34.82,48.03 35.23,48.03 35.23,51.18 | DC_IN.1 46.61,4.01 46.38,3.79 46.38,2.24 45.31,1.17 42.9,1.17 41.5,2.57 DC_IN.3 41.5,4.52 39.55,6.48 38.25,6.48 36.88,7.85 34.65,7.85 34.54,7.95 TR-A15.3 34.37,10.59 34.09,10.87 PDR15.2 36.8,10.87 40.44,14.5 40.44,16 38.46,17.98 34.87,17.98 | 34.92,18.03 34.87,17.98 | 34.92,18.03 TR-A14.3 | 34.87,17.98 34.8,17.91 | 35.23,51.18 34.01,51.18 | 34.92,18.03 34.77,18.19 34.77,20.4 34.74,20.4 PDR14.2 35.2,20.45 38.61,23.85 38.96,23.85 40.26,25.15 40.26,27.41 38.96,28.7 35.03,28.7 | 35,28.68 35.03,28.7 | 35,28.68 35.03,28.7
  Bottom 0.61: 38.71,90.75 41.93,90.75 | 41.93,90.75 42.16,90.75 | 33.78,90.75 38.71,90.75 | 30.07,90.75 33.78,90.75 | 26.11,90.75 30.07,90.75 | 22.25,90.75 26.11,90.75 | 17.93,90.75 22.25,90.75 | 14.25,90.75 14.68,90.75 | 14.68,90.75 17.93,90.75 | 14.25,90.75 10.85,90.75 10.95,90.65 | C3.2 38.71,90.6 38.71,90.75 | 33.78,90.75 33.78,90.58 34.31,90.58 C4.2 34.42,90.32 34.47,87.91 RESET.1 35.74,87.63 36.6,86.77 36.6,81.28 36.52,81.28 RS232.1 | 30.07,90.75 30.07,90.48 30.64,90.48 C5.2 30.81,90.65 30.81,90.7 | 26.11,90.75 26.11,90.53 26.39,90.53 C6.2 | 22.25,90.75 22.25,90.6 | 22.25,90.6 22.25,90.58 | 17.93,90.75 17.93,90.48 18.37,90.48 C8.2 | 14.25,90.75 14.25,90.58 14.63,90.58 C9.2 14.73,90.7 14.68,90.75 | 10.95,90.65 11.63,90.65 | 23.57,66.6 23.62,66.55 23.65,66.55 | 46.76,90.45 C2.2 | 46.76,90.45 46.81,90.4 | 41.93,90.75 41.93,90.5 41.94,90.5 C1.2 | 3.05,52.38 3.05,52.35 | 23.62,66.5 23.5,66.5 | 23.62,66.5 IC1.19 23.65,66.55 | 23.62,66.5 27.13,66.5 27.69,67.06 27.69,76.02 | 27.69,76.02 27.69,76.18 | 14.68,90.75 14.78,90.65 | 3.91,21.84 3.9,21.84 3.9,21.78 3.91,21.77 3.94,21.79 v3.96,21.79 | 100UF2.- 3.9,20.21 3.91,20.22 4.21,19.92 | IC1.8 34.54,69.09 34.75,69.29 36.2,69.29 36.52,68.96 36.52,68.91 36.53,63.68 | 36.53,63.14 36.52,58.83 v34.95,57.23 | 36.53,63.14 36.53,63.68 | U$1.15 44.17,74.52 45.06,73.64 45.06,63.65 44.96,63.65 44.96,63.68 | 36.52,63.14 36.53,63.17 36.53,63.14 | C1.2 47.6,89.38 v47.6,87.76 47.6,87.78 | 8.38,49.58 4.12,49.58 3.1,50.6 SERIAL.1 | SERIAL.1 3.1,52.48 | 36.53,63.68 36.52,63.68 | 36.53,63.68 44.96,63.68 | 44.96,63.68 45.03,63.68 | 46.76,90.45 46.71,90.5 C1.2 | 3.05,52.38 3.05,52.04 | SERIAL.1 3.05,52.38
  Bottom 0.61: SERPDR.2 3.05,56.26 3.05,52.38 | 27.69,76.02 27.69,76.45 24.89,79.27 21.59,82.58 ICSP.3 | 23.65,66.55 23.62,66.57 v25.02,66.57 10.29,66.57 8.31,64.59 8.33,64.57 v8.33,64.52 | 47.6,87.78 47.57,87.81 | 47.6,87.78 47.68,87.71 47.68,87.15 50.77,84.05 56.13,84.05 56.95,83.24 56.95,78.31 55.8,77.17 54.61,77.17 54.46,77.32 RS232PWR.1 | C7.2 22.3,90.6 22.28,90.58 22.25,90.6 | 10.44,90.22 C10.2 | 10.95,90.65 10.52,90.22 10.44,90.22 | 4.29,87.81 4.22,87.73 | 4.29,87.81 X1.2 | 4.9,87.88 5.11,87.88 5.11,84.33 8.2,81.23 15.72,81.23 17.02,82.53 19.2,82.53 19.23,82.5 | 4.9,87.88 4.37,87.88 4.29,87.81 | ICSP.3 19.15,82.58 | 19.23,82.5 19.3,82.42 | ICSP.3 19.23,82.5 | 4.9,87.88 4.9,87.78 7.34,90.22 10.44,90.22
  Bottom 1.27: 3.9,21.84 3.9,20.36 3.66,20.12 100UF2.- 3.91,20.14 | ZENER.A 4.21,19.92 | IN/OUT/OW.1 8.38,49.58 9.65,49.58 11.02,50.95 11.02,57.05 v11.35,57.38
N$1
  Top 0.61: X4.10 21.87,4.75 21.39,5.23 SER20.2 15.67,5.13 15.6,5.06 15.49,5.16 12.95,5.16 PUR20/SDI.1
N$2  (via drill 0.6)
  Top 0.61: 41.68,67.84 T1IN.P$2 41.68,69.44 v41.63,69.44
  Bottom 0.61: v41.63,69.44 U$1.11
N$3
  Top 0.61: X4.7 21.84,19.99 19.92,21.92 SER17.2 15.67,21.95 12.9,21.95 | 12.9,21.95 12.78,21.95 | PUR17.1 12.9,21.95
N$4  (via drill 0.6)
  Top 0.61: R1OUT.P$2 39.32,70.71 v40.61,70.71
  Bottom 0.61: U$1.12 42.95,70.73 42.95,70.74 40.54,70.74 v40.61,70.71
N$5
  Bottom 0.61: 42.98,68.17 U$1.10 40.41,68.17 T1IN1.P$2
N$6
  Bottom 0.61: 43.36,66.9 U$1.9 T1IN2.P$2
N$7  (via drill 0.6)
  Top 0.61: 39.56,96.25 39.52,96.29 | 39.56,96.25 43.54,92.28 45.39,92.28 47.7,94.59 47.73,94.59 49.2,96.06 50.47,96.06 v50.49,96.09 | v20.22,71.09 20.09,71.15 22.02,71.15 25.38,74.5 25.38,89.33 24.59,90.12 24.59,96.6 25.48,97.48 38.35,97.48 39.57,96.27 39.56,96.25
  Bottom 0.61: v20.22,71.09 20.88,71.63 23.62,71.63 | 23.62,71.63 23.6,71.6 | 23.62,71.63 IC1.23 | SER1.2 56.46,96.98 55.55,96.06 50.49,96.06 v50.49,96.09 50.47,96.06 50.47,95.91 47.88,93.32 46.5,93.32 C1.1
N$8  (via drill 0.6)
  Top 0.61: SER17.1 15.77,18.59 19.1,18.59 20.3,17.4 22.71,17.4 v22.73,17.42 | v38.56,60.6 38.46,60.5 19.76,60.5 18.82,61.44 v18.82,75.26
  Bottom 0.61: v22.73,17.42 22.76,17.45 26.01,17.45 35.69,27.13 35.64,55.8 38.58,58.83 v38.56,60.6 | IC1.26 23.65,75.46 19.03,75.46 v18.82,75.26
N$9  (via drill 0.6)
  Top 0.61: 39.85,98.5 39.67,98.68 | 39.85,98.5 42.77,95.58 v44.91,95.58 | v15.6,69.16 15.49,69.27 15.49,74.3 11.68,78.11 11.68,87.88 15.49,91.69 15.49,95.33 17.04,96.88 19.23,96.88 20.45,95.66 20.45,94.54 21.06,93.93 22.53,93.93 23.29,94.69 23.29,97.59 24.61,98.91 39.5,98.91 39.88,98.53 39.85,98.5
  Bottom 0.61: C2.1 43.15,93.9 43.36,93.9 43.36,94.08 v44.91,95.58 | SER2.2 49.2,97.13 47.65,95.58 v44.91,95.58 | IC1.21 15.54,69.09 15.54,69.16 v15.6,69.16 | v44.91,95.58 43.79,94.54 | v44.91,95.58 44.86,95.58
N$11  (via drill 0.6)
  Top 0.61: 15.77,7.39 15.82,7.34 | 15.77,7.39 SER19.1 17.04,7.39 17.58,6.86 v17.58,6.81 | 15.77,7.39 15.75,7.42
  Bottom 0.61: IC1.16 15.34,62.74 14.3,61.7 14.3,57.23 14.81,56.72 14.81,25.45 17.35,22.91 17.35,7.01 17.55,6.81 v17.58,6.81
N$12  (via drill 0.6)
  Top 0.61: v18.67,95.3 18.67,90.96 19.99,89.64 22.02,89.64 23.95,87.68 v23.95,85.27
  Bottom 0.61: C8.1 v18.67,95.3 18.67,97.99 18.7,97.99 SER8.1 | 33.79,76.65 33.76,76.61 32.66,76.61 23.95,85.32 v23.95,85.27 23.88,85.5 | 33.79,76.65 33.91,76.76 | 33.79,76.65 33.78,76.66 33.83,76.71 IC1.2
N$13  (via drill 0.6)
  Top 0.61: 28.09,40.82 27.33,40.82 25.4,42.75 25.4,45.64 23.62,47.4 18.24,47.4 | 28.09,40.82 29.87,40.82 | 29.87,40.82 29.9,40.82 29.9,40.79 | 15.98,49.61 15.97,49.6 SER12.1 15.87,49.45 16.13,49.45 18.24,47.35 18.24,47.4 | 18.24,47.4 18.19,47.4 | 28.09,40.82 28.09,40.79 28.04,40.84 27.94,40.84 | 29.87,40.82 29.9,40.79 | 29.85,40.97 29.85,40.84 29.9,40.79 | 29.85,40.97 v29.85,41.68 | TR-A12.1 33.43,33.86 31.37,35.92 31.37,40.72 31.14,40.94 | 31.14,40.94 31.12,40.97 29.85,40.97 | 31.14,40.94 PDR12.1
  Bottom 0.61: IC1.13 33.2,62.74 29.87,59.41 29.87,41.71 v29.85,41.68
N$14  (via drill 0.6)
  Top 0.61: 29.44,31.32 29.08,31.32 27.34,33.06 27.36,33.07 27.33,33.1 27.28,33.1 25.83,34.54 25.83,36.12 24.11,37.85 20.88,37.85 17.76,40.97 15.93,40.97 15.85,40.89 15.87,40.87 SER13.1 | v29.39,32.82 29.44,32.77 29.44,31.32 | TR-A13.1 32.99,24.08 31.75,25.32 31.75,30.89 31.32,31.32 PDR13.1 31.3,31.34 31.29,31.34 31.27,31.32 29.44,31.32
  Bottom 0.61: IC1.12 32.77,64.01 28.52,59.77 28.52,33.6 29.31,32.82 v29.39,32.82
N$15  (via drill 0.6)
  Top 0.61: 15.87,35.26 15.87,35.25 SER14.1 15.8,35.23 | 26.24,29.9 26.24,24.46 30.25,20.45 PDR14.1 | 15.8,35.23 15.7,35.23 | 15.8,35.23 18.06,35.23 20.09,33.2 23.98,33.2 26.24,30.94 26.24,29.9 | v27.25,29.82 27.18,29.9 26.24,29.9 | TR-A14.1 33.5,13.41 31.67,15.24 31.67,20.07 PDR14.1 | PDR14.1 31.14,20.6 | PDR14.1 | PDR14.1 31.34,20.5 | PDR14.1
  Bottom 0.61: IC1.11 32.38,65.28 27.25,60.15 v27.25,29.82
N$16
  Top 0.61: 42.06,42.57 PUOR12.1 | LED12.- 44.32,42.65 44.3,42.62 | 53.19,43.48 53.21,43.46 OUTPUT1.4
  Top 1.27: POLYFUSE12.2 40.79,41.3 42.06,42.57 | PUOR12.1 44.3,42.62 | LED12.- 44.25,41.3 45.01,40.54 50.24,40.54 53.19,43.48
  Bottom 0.61: OUTPUT1.4 53.24,43.59 53.07,43.41 FBD12.2 47.09,43.41 46.73,43.04 ZENER2.C | 38.2,41.33 38.23,41.35 | 38.2,41.33 POLYFUSE12.2 | U$5.P$1 38.18,41.3 38.2,41.33
N$17
  Top 1.27: TR-A15.2 35.79,5.64 37.13,4.29 38.76,4.29 38.86,4.19 POLYFUSE15.1
  Bottom 0.61: 38.76,4.19 38.66,4.09 | POLYFUSE15.1 38.76,4.19 | U$8.P$2 38.86,4.29 38.76,4.19
N$18
  Top 1.27: 53.29,12.93 53.42,12.93 | 53.29,12.93 OUTPUT1.10 | 53.29,12.93 51.64,12.93 49.4,10.69 46,10.69 LED15.- 43.79,12.8 43.76,12.78 42.57,12.78 PUOR15.1 41.38,12.73 38.89,10.24 38.89,9.27 38.86,9.25 38.84,9.27 POLYFUSE15.2
  Bottom 0.61: 53.39,12.98 53.42,12.95 | OUTPUT1.10 53.39,12.98 | 53.39,12.98 50.8,15.57 46.89,15.57 46.89,15.63 FBD15.2 | FBD15.2 47.04,15.65 | ZENER5.C 44.03,15.65 FBD15.2 | POLYFUSE15.2 38.91,9.27 38.86,9.22 U$8.P$1
N$19  (via drill 0.6)
  Top 0.61: v50.19,67.64 49.05,67.64 47.57,69.11 47.57,80.39 RS232.5
  Bottom 0.61: U$1.7 49.66,68.17 v50.19,67.64
N$20
  Top 0.61: X4.6 21.92,25.04 21.89,25.07 20.7,25.07 18.24,27.53 SER16.2 15.67,27.58 PUR16.1
N$21
  Top 0.61: 38.4,15.62 POLYFUSE14.1 | TR-A14.2 35.36,15.62
  Top 1.27: 35.36,15.62 38.4,15.62
  Bottom 0.61: POLYFUSE14.1 38.35,15.65 38.28,15.72 U$7.P$2
N$22
  Top 0.61: LED14.- 44.17,22.45 | 53.29,23.04 53.24,23.09 OUTPUT1.8
  Top 1.27: 44.17,22.45 46.05,20.57 51.59,20.57 52.02,21.01 52.02,21.77 53.29,23.04 | POLYFUSE14.2 38.35,20.83 40.28,20.83 PUOR14.1 43.86,23.09 43.89,23.06 43.92,23.09 LED14.-
  Bottom 0.61: OUTPUT1.8 53.24,23.09 53.26,23.06 53.22,23.02 FBD14.2 46.86,23.02 46.87,23 | 46.87,23 ZENER4.C | 46.87,23 46.96,22.91 | 38.38,20.75 38.43,20.8 | 38.38,20.75 POLYFUSE14.2 | U$7.P$1 38.28,20.65 38.38,20.75
N$23
  Top 0.61: TR-A13.2 35.13,26.31 35.08,26.26 35.1,26.24
  Top 1.27: 35.1,26.24 POLYFUSE13.1
  Bottom 0.61: POLYFUSE13.1 38.4,26.24 38.48,26.31 38.25,26.54 U$6.P$2
N$24
  Top 0.61: 43.99,33.25 44.09,33.15 | 43.99,33.25 LED13.- | 43.84,33.4 43.99,33.25 | 38.4,31.32 38.53,31.19 | 53.47,33.32 53.44,33.3 OUTPUT1.6
  Top 1.27: 43.84,33.4 PUOR13.1 40.28,31.34 38.35,31.34 POLYFUSE13.2 38.4,31.32 | 44.09,33.15 44.09,32.13 45.31,30.91 51.05,30.91 53.44,33.3
  Bottom 0.61: OUTPUT1.6 53.19,33.35 52.97,33.13 FBD13.2 47.03,33.13 47.04,33.12 46.62,32.7 ZENER3.C | 38.35,31.32 38.38,31.34 | 38.35,31.32 POLYFUSE13.2 | U$6.P$1 38.25,31.22 38.35,31.32
N$25
  Top 0.61: X4.4 20.98,35.23 17.6,38.61 SER14.2 15.65,38.61 15.6,38.66 PUR14.2
N$26
  Top 0.61: X4.2 21.89,45.39 22.05,45.49 17.83,45.49 17.12,46.2 SER12.2 15.57,46.2 15.55,46.18 PUR12.2
N$27
  Top 0.61: POLYFUSE12.1 38.38,36.2 37.59,36.17 37.85,36.2
  Top 1.27: TR-A12.2 37.85,36.2
  Bottom 0.61: POLYFUSE12.1 38.2,36.25 38.18,36.27 U$5.P$2
N$28
  Top 0.61: 22.02,40.23 X4.3 18.16,44.09 SER13.2 15.72,44.09 15.69,44.07 PUR13.2
N$29
  Top 0.61: TR-A11.2 34.87,45.77 35.08,45.97
  Top 1.27: POLYFUSE11.1 38,45.03 37.06,45.97 35.08,45.97
  Bottom 0.61: POLYFUSE11.1 38.53,45.01 38.56,45.03 U$4.P$2
N$30
  Top 0.61: 41.5,52.4 41.53,52.38 PUOR11.1 | 43.38,52.38 LED11.- 43.74,52.63 | 53.47,53.57 53.42,53.62 OUTPUT1.2
  Top 1.27: POLYFUSE11.2 39.22,50.11 41.5,52.4 | PUOR11.1 43.38,52.38 | 43.74,52.63 46.05,50.37 50.29,50.37 53.47,53.57
  Bottom 0.61: 53.26,53.59 OUTPUT1.2 53.1,53.75 FBD11.2 46.91,53.75 46.99,53.67 46.85,53.53 ZENER1.C | POLYFUSE11.2 38.51,50.09 38.43,50.01 38.56,49.89 U$4.P$1
N$31
  Bottom 0.61: 23.77,77.88 IC1.28 21.62,80.04 ICSP.4 19,80.04
N$32
  Top 0.61: 21.95,30.05 22.07,29.92 | 21.95,30.05 X4.5 | 21.95,30.05 21.74,30.25 20.75,30.25 17.98,33.02 SER15.2 15.75,33.02 15.65,33.12 PUR15.1
N$33  (via drill 0.6)
  Top 0.61: 15.97,29.72 16,29.69 15.93,29.62 SER15.1 18.31,29.59 v20.3,27.61 20.14,27.66 24.03,27.66 25.1,26.59 25.07,12.34 26.47,10.95 PDR15.1 30.61,4.88 31.95,3.53 34.27,3.53 34.47,3.33 | 34.47,3.33 | 34.47,3.33 TR-A15.1
  Bottom 0.61: 20.47,27.66 v20.3,27.61 20.3,27.74 | IC1.7 33.98,70.36 34.01,70.33 32.89,70.33 32.79,70.23 32.77,70.23 31.12,68.58 31.12,65.61 25.4,59.87 25.4,28.55 24.51,27.66 20.47,27.66 | 20.47,27.66 20.3,27.66 20.3,27.74 | 20.3,27.74 20.27,27.64
N$34  (via drill 0.6)
  Top 0.61: v35.89,71.83 35.89,77.06 33.27,79.68 33.27,81.74 31.19,83.82 31.19,89.87 33.04,91.72 37.77,91.72 37.77,91.69 38.91,92.84 38.91,94.77 38.23,95.45 v38.25,95.45
  Bottom 0.61: SER3.2 44.14,97.61 41.83,95.3 38.38,95.3 38.23,95.45 v38.25,95.45 38.3,95.45 38.48,95.28 C3.1 | IC1.6 35.69,71.63 v35.89,71.83 35.92,71.81 35.92,71.12 T1IN2.P$1
N$35  (via drill 0.6)
  Top 0.61: Q21.2 31.09,68.15 32.77,66.52 35.1,66.52 v35.18,66.6
  Bottom 0.61: IC1.10 33.98,66.52 34.06,66.6 v35.18,66.6
N$36  (via drill 0.6)
  Top 0.61: 3.28,41.25 3.38,41.15 TR-A111.1 3.48,41.02 3.3,40.84 v1.52,40.84
  Bottom 0.61: v1.52,40.84 0.81,41.55 0.81,62.23 0.81,62.2 0.81,62.79 1.73,63.7 2.92,63.7 | 2.82,59.97 2.74,59.97 SERPDR.1 2.69,60.12 2.92,60.12 2.92,63.7 | 2.92,63.7 2.92,63.73 4.62,63.73 SERIAL_INVERT.P$2
N$37
  Top 0.61: ICSP.1 19.28,87.71 15.87,87.71 ISCPRES.1
  Bottom 0.61: 33.88,83.95 RESET.2 | 19.2,87.68 19.15,87.68 | ICSP.1 19.2,87.68 | 33.88,83.95 30.15,87.68 19.2,87.68 | IC1.1 33.96,83.57 33.88,83.95
N$38
  Top 0.61: SERIAL.2 5.64,50.62 6.33,49.94 8.03,49.94 9.5,48.46 9.52,48.39 9.52,39.5 8.46,38.43 5.89,38.43 5.72,38.61 SERPUR.2 5.77,37.89 | 5.77,37.89 5.77,37.85 | TR-A111.2 5.77,41.12 5.77,37.89
  Bottom 0.61: 5.77,53.34 5.77,52.4 5.74,52.43 SERIAL.2 5.64,52.45 5.59,52.5 5.71,52.63 SERSER.P$2
N$39  (via drill 0.6)
  Top 0.61: 35.31,67.89 v35.28,68.1 35.36,67.87 35.28,67.87 33.78,69.37 33.78,73.53 30.94,76.38 30.94,79.07 30.91,79.1 30.86,79.05 Q21.1
  Bottom 0.61: IC1.9 33.96,67.87 33.93,67.89 33.96,67.92 33.91,67.89 35.08,67.89 v35.28,68.1
N$40
  Bottom 0.61: 23.72,76.71 23.75,76.73 | 23.72,76.71 IC1.27 20.12,76.71 19.23,77.6 | 23.72,76.71 23.7,76.68 | 19.23,77.6 19.18,77.65 | ICSP.5 19.23,77.6
N$41  (via drill 0.6)
  Top 0.61: v26.87,65.08 38.1,65.08 38.71,65.68 R1OUT.P$1 38.68,67.62 | 9.75,95.1 v9.78,95.1 9.78,92.3 7.44,89.97 7.44,76.45 10.57,73.33 10.57,66.19 11.18,65.58 11.18,65.3 v11.2,65.28
  Bottom 0.61: 8.03,97.97 8.31,98.25 8.56,97.99 SER10.2 8.56,96.22 9.68,95.1 v9.78,95.1 | 11.2,65.3 v11.2,65.28 IC1.18 26.77,65.28 v26.87,65.08
N$42
  Bottom 0.61: 13.59,101.17 13.59,101.12 | 13.59,101.17 SER9.1 13.66,101.19 13.66,100.08 13.11,99.52 11.76,99.52 11.23,98.98 PUR9.2 11.23,96.14 13.87,93.5 C9.1 | X3.9 13.59,106.3 13.59,101.17
N$43  (via drill 0.6)
  Top 0.61: v31.62,95 30.02,95 28.96,93.88 28.96,75.44 v29.34,75.06
  Bottom 0.61: C5.1 30.76,93.3 31.42,93.6 31.62,93.62 v31.62,95 33.93,97.31 33.93,98.1 | IC1.4 33.93,74.14 33.91,74.14 | 33.91,74.14 33.65,74.14 33.55,74.24 33.6,74.3 36.93,74.3 38.99,72.24 T1IN1.P$1 38.99,71.93 | 33.91,74.14 33.91,74.12 30.3,74.12 29.36,75.06 v29.34,75.06 | 33.93,98.1 33.93,98.17 | 33.93,98.1 SER5.2
N$44  (via drill 0.6)
  Top 0.61: v14.02,63.98 13.87,63.98 13.89,64.01 13.92,73.94 10.36,77.5 10.36,88.52 14.15,92.3 14.15,92.73 14.1,92.73 | 14.1,92.73 14.1,92.51 | 14.1,92.73 v14.1,95.91 | T1IN.P$1 41.68,64.16 41.07,63.55 v26.44,63.55
  Bottom 0.61: 13.92,64.01 IC1.17 25.98,64.01 v26.44,63.55 | v14.02,63.98 13.92,63.98 13.89,64.01 13.92,64.01 | 13.92,64.01 12.83,62.92 12.85,62.92 8.71,58.78 C6SERIAL.P$1 | 13.61,97.77 13.61,97.61 | 13.92,96.09 v14.1,95.91 14.1,95.94 13.61,96.42 13.61,97.61 | 13.61,97.61 13.54,97.61 13.64,97.71 SER9.2
N$45  (via drill 0.6)
  Top 0.61: v47.83,65.86 46.61,65.86 46.23,66.24 46.23,77.65 44.04,79.83 44.04,81.33 RS232.4
  Bottom 0.61: U$1.8 47.83,66.88 v47.83,65.86
N$49
  Bottom 0.61: 43.18,73.25 U$1.14 41.58,73.25 40.89,73.94 40.89,78.69 41.58,79.38 41.58,81.36 | 41.58,81.36 41.58,81.51 | 41.58,81.36 RS232.3
N$52
  Top 0.61: OUTPUT1.9 53.24,17.98 53.26,17.96 53.21,17.91 45.87,17.91 | 44.4,26.47 44.47,26.39 | 44.4,26.47 LEDR14.2 44.27,26.77 | PUOR14.2 44.38,26.49 44.4,26.47 | OUTPUT1.7 53.42,28.22 53.44,28.25 53.09,28.6 46.1,28.6 | 54.25,58.7 OUTPUT1.1 53.26,58.7 53.44,58.88 53.19,59.13 45.59,59.13 43.82,57.35 LEDR11.2 43.84,55.65 | 56.92,48.51 56.16,48.51 56.13,48.54 | 56.9,38.4 56.16,38.38 | LEDR13.2 43.84,36.78 43.76,36.7 43.66,36.8 PUOR13.2 | OUTPUT1.5 53.67,38.38 53.7,38.4 53.39,38.71 | 56.95,28.68 56.16,28.68 56.08,28.6 | PUOR12.2 43.86,46.02 44.09,46.25 LEDR12.2 44.25,46.13 | 53.42,48.54 53.47,48.49 | OUTPUT1.3 53.42,48.54 | 53.42,48.54 53.06,48.44 | 43.84,55.65 44.04,55.45 | PUOR11.2 43.71,55.78 43.84,55.65
  Top 1.27: 44.17,16.21 LEDR15.2 | 44.17,16.21 45.87,17.91 54.66,17.91 56.92,20.22 56.95,28.68 56.9,38.4 56.92,48.51 56.95,56.01 54.25,58.7 | 44.27,26.77 46.1,28.6 56.08,28.6 | OUTPUT1.1 53.06,58.7 | 56.13,48.54 OUTPUT1.3 | 56.16,38.38 OUTPUT1.5 | LEDR13.2 44.04,37.85 44.91,38.71 53.39,38.71 | 44.25,46.13 46.91,48.44 53.06,48.44 | 53.19,59.13 52.91,58.57 52.48,59 | 44.17,16.21 44.15,16.21 44.07,16.13 PUOR15.2
  Bottom 0.61: 53.39,18.06 53.52,17.93 | OUTPUT1.9 53.39,18.06 | 53.39,18.06 53.32,18.13 | 53.36,28.24 53.34,28.22 OUTPUT1.7 | 53.36,28.24 FBD13.1 46.79,28.42 46.71,28.5 46.52,28.3 ZENER3.A | 53.36,28.24 53.49,28.37 | OUTPUT1.5 53.24,38.43 53.26,38.46 53.19,38.52 FBD12.1 46.62,38.52 46.5,38.64 ZENER2.A | 53.42,48.54 53.47,48.49 | OUTPUT1.3 53.42,48.54 | 53.42,48.54 53.09,48.86 FBD11.1 46.89,49 46.75,49.13 ZENER1.A | 46.76,18.09 46.88,18.09 FBD14.1 46.81,18.13 46.76,18.09 | 46.76,18.09 46.24,18.6 | OUTPUT1.9 53.52,18.06 53.57,18.11 53.55,18.13 | 53.16,18.06 53.14,18.03 | 53.16,18.06 OUTPUT1.9 | 53.9,18.14 53.24,18.14 53.16,18.06 | 46.88,10.79 46.86,10.79 | ZENER5.A 43.65,10.87 | 46.81,10.87 46.88,10.79 | 46.88,10.79 FBD15.1
  Bottom 1.27: 43.6,10.85 43.56,10.85 | 43.6,10.85 ZENER5.A 43.64,10.8 43.64,10.72 45.03,10.72 45.06,10.52 45.06,7.77 45.03,7.57 | 46.81,10.87 46.78,10.85 43.6,10.85 | 43.65,10.87 43.55,10.97 41.6,10.97 40.86,11.72 | 40.86,11.72 40.77,11.81 | 43.72,18.52 43.79,18.52 | 43.72,18.52 ZENER4.A 46.65,18.6 46.91,18.34 46.84,18.26 FBD14.1 53.08,18.13 53.16,18.21 53.24,18.14 OUTPUT1.9 | 43.72,18.52 41.27,18.52 40.69,17.93 40.69,11.86 40.84,11.71 40.86,11.72 | 45.03,7.57 45.01,7.54 | SOURCE.2 45.03,7.57
N$55
  Top 0.61: LEDRESMAIN.1 8.44,10.49 8.43,10.49 8.36,10.41 LED200.-
N$60
  Bottom 0.61: U$1.13 41.15,71.98 38.99,74.14 38.99,81.36 RS232.2
N$63
  Top 0.61: 8.43,28.04 8.46,28.02 VR1.1 | 8.56,27.92 8.56,26.49 | 8.84,20.32 8.81,20.35 CMAIN.1
  Top 1.27: 8.46,28.02 8.56,27.92 | 8.81,20.35 6.25,22.91 6.25,24.18 6.35,24.28 | 8.56,26.49 6.35,24.28 | 6.35,24.28 6.27,24.21 VR2.1
  Bottom 0.61: 8.48,27.84 VR1.1
  Bottom 1.27: 14.48,1.73 14.53,1.68 | 14.48,1.73 12.6,3.61 12.6,17.14 14.02,18.62 14.02,21.77 8.48,27.3 8.48,27.84 | POLYFUSE200.2 15.09,1.12 14.48,1.73
N$71
  Top 0.61: LED15.+ 47.85,12.67 47.93,12.88 47.57,12.47 LEDR15.1
N$72
  Top 0.61: LED14.+ 48.36,23.09 48.39,23.11 47.67,23.83 LEDR14.1
N$73
  Top 0.61: 48.11,33.3 48.13,33.27 | LED13.+ 48.11,33.3 | LEDR13.1 47.45,33.96 48.11,33.3
N$74
  Top 0.61: LED12.+ 48.44,42.72 48.46,42.75 47.65,43.56 LEDR12.1
N$75
  Top 0.61: LEDR11.1 47.22,55.29 47.19,55.27 47.75,54.71 LED11.+
N$77
  Bottom 0.61: 44.09,106.55 44.09,106.43 X3.3 44.12,106.38 | PUR3.2 41.68,99.06 42.27,99.64 43.54,99.64 44.04,100.15 44.04,101.12 44.2,101.27 44.14,101.32 SER3.1 44.14,106.35 44.12,106.38 | 44.12,106.38 43.99,106.5
N$80
  Bottom 0.61: U$1.5 48.46,70.71 48.51,70.66 48.56,70.71 RC2.2
N$81
  Bottom 0.61: U$1.3 46.86,73.25 46.18,73.94 46.18,77.7 49.02,80.54 49.09,80.47 RC1.2
N$82
  Bottom 0.61: RC2.1 52.24,73.51 51.61,73.56 50.04,71.98 U$1.4
N$83
  Bottom 0.61: 48.34,75.79 U$1.1 48.21,75.79 48.23,75.77 49.43,76.96 RC1.1
N$84
  Top 0.61: RS232PWR.3 54.69,82.35 | RS232PWR.3 55.4,82.4 | RS232PWR.3 55.27,82.32 55.32,82.27 55.22,82.17 55.4,82.37 51.92,82.37 RC4.1
  Bottom 0.61: RS232PWR.3 54.69,82.37 | RS232PWR.3 55.07,82.35 | U$1.2 49.71,74.52 51.82,76.63 51.82,82.12 52.12,82.42 54.97,82.42 RS232PWR.3
N$85  (via drill 0.6)
  Top 0.61: 49.02,76.91 49.02,70.21 49.73,69.49 49.81,69.49 v49.81,69.44 | 49.02,76.91 49.02,77.19 | 55.09,79.88 55.09,79.81 RS232PWR.2 53.85,79.81 49.53,79.81 49,79.05 49,76.91 49.02,76.91 | 49.55,74.14 49.71,74.14 | 49.55,74.14 RC5.2 | 49.02,76.91 49.02,74.14 49.55,74.14
  Bottom 0.61: U$1.6 v49.81,69.44
N$86
  Bottom 0.61: 38.99,106.35 39.04,106.35 X3.4 39.06,106.4 | PUR4.2 36.52,99.19 37.11,99.77 38.46,99.77 38.96,100.28 38.96,101.24 39.06,101.35 SER4.1 39.06,106.4 | 39.06,106.4 39.09,106.43
N$87
  Bottom 0.61: 33.96,106.4 33.96,106.63 | 33.96,106.4 X3.5 | 33.96,106.4 33.96,101.47 SER5.1 34.01,101.45 34.04,101.42 34.04,100.33 33.45,99.75 32,99.75 31.47,99.21 PUR5.2
N$88
  Bottom 0.61: 18.69,106.43 18.69,106.63 | 18.69,106.43 X3.8 | 18.69,106.43 18.69,101.4 SER8.2 18.75,100.1 18.24,99.59 16.74,99.59 16.15,99.01 16.15,98.12 16.26,98.02 16.21,97.97 PUR8.2
N$89
  Bottom 0.61: 54.33,106.4 54.33,106.5 | 54.33,106.4 X3.1 54.3,106.43 | 54.33,106.4 54.53,106.2 | 56.46,101.35 56.52,101.4 | 56.46,101.35 SER1.1 56.44,101.32 56.44,104.29 54.3,106.43 | PUR1.2 56.46,101.34 56.46,101.35 | 54.3,106.43 54.25,106.48
N$90  (via drill 0.6)
  Top 0.61: 30.8,51.04 31.04,50.8 31.04,45.24 32.82,43.46 32.82,43.48 | 30.8,51.04 30.71,51.13 | 28.98,51.26 27.48,51.26 24.87,48.64 19.79,48.64 16.97,51.46 15.87,51.46 15.87,51.59 SER11.1 | 28.98,51.26 29.01,51.26 | 28.98,51.26 28.98,51.28 29.01,51.26 | 32.82,43.48 | 32.82,43.48 v32.82,43.51 32.87,43.51 32.92,43.46 TR-A11.1 | 29.01,51.26 PDR11.1 30.76,51.26 30.89,51.13 30.8,51.04
  Bottom 0.61: IC1.14 33.68,61.47 33.68,44.37 v32.82,43.51
N$91
  Bottom 0.61: 49.28,106.55 49.28,106.43 X3.2 49.22,106.48 49.2,106.5 SER2.1 49.2,101.32 49.02,101.14 49.02,100.1 48.59,99.67 47.35,99.67 46.74,99.06 PUR2.2
N$92
  Top 0.61: X4.1 22.05,50.47 22.07,50.49 17.55,55.02 SER11.2 13.33,55.02 13.23,54.91 PUR11.2
N$95  (via drill 0.6)
  Top 0.61: v29.57,72.8 27.81,74.55 27.81,94.64 29.34,96.19 32.92,96.19 35.43,96.16 v36.07,95.5
  Bottom 0.61: SER4.2 36.57,95.5 v36.07,95.5 36.02,95.5 34.42,93.9 C4.1 | v29.57,72.8 29.64,72.87 33.65,72.87 | 33.65,72.87 33.98,72.87 | 33.65,72.87 33.65,72.9 IC1.5
N$99  (via drill 0.6)
  Top 0.61: v17.02,74.17 16.97,74.27 16.97,61.32 v17.91,60.38 17.96,60.32 | SER16.1 15.67,24.18 | SER16.1 15.75,24.16 | SER16.1 15.85,24 17.3,24 17.91,24.61 v17.91,26.16
  Bottom 0.61: IC1.25 v17.02,74.17 17.98,74.17 18.03,74.22 14.71,74.22 | v17.91,60.38 17.93,60.43 18.36,59.99 18.36,26.19 18.29,26.16 18.26,26.16 | 18.26,26.16 18.24,26.19 | v17.91,26.16 18.26,26.16 | 14.71,74.22 14.66,74.22 | B4SERIAL.P$2 6.99,65.53 10.54,69.09 10.54,71.93 12.83,74.22 14.71,74.22
N$100
  Top 0.61: X4.9 21.92,9.83 21.82,9.73 20.75,10.79 SER19.2 15.7,10.62 15.6,10.52 15.39,10.72 12.95,10.72 12.95,10.77 PUR19/SDO.1
N$102
  Top 0.61: 21.95,14.83 X4.8 22,14.86 | PUR18.1 12.85,16.43 12.85,16.36 15.44,16.36 15.6,16.21 15.67,16.28 SER18.2 17.19,14.86 22,14.86 | 22,14.86 22.02,14.86
N$104
  Bottom 0.61: B4SERIAL.P$1 6.93,60.96 5.71,60.96 | 5.71,60.96 SERIAL_INVERT.P$1 | SERSER.P$1 5.71,60.93 | 5.71,60.93 5.71,60.96 | C6SERIAL.P$2 5.71,58.78 5.71,60.93
N$106
  Bottom 0.61: 28.96,106.43 28.98,106.43 28.98,106.05 | 28.98,106.05 28.98,101.47 SER6.1 28.85,101.34 28.85,99.9 28.68,99.72 27.03,99.72 26.42,99.11 26.42,98.02 PUR6.2 | 26.26,98.15 26.26,98.07 PUR6.2 | PUR6.2 25.78,97.39 25.78,96.88 25.02,96.11 25.02,94.72 26.14,93.6 26.54,93.6 26.54,93.48 C6.1 | 28.98,106.05 28.91,106.05 X3.6
N$107  (via drill 0.6)
  Top 0.61: v26.37,72.47 26.52,72.62 26.52,95.48 v26.49,95.5
  Bottom 0.61: SER6.2 28.5,97.59 28.5,95.78 28.22,95.5 v26.49,95.5 | v26.37,72.47 26.37,71.3 25.38,70.31 23.65,70.31 23.65,70.33 IC1.22 23.65,70.36 23.7,70.31
N$108
  Bottom 0.61: 24,106.2 24,106.1 | 24,106.2 X3.7 | 24,106.2 24,106.86 23.88,106.98 23.88,101.34 SER7.2 23.93,101.29 24,101.22 23.8,101.02 23.8,99.8 23.6,99.59 21.84,99.59 21.23,98.98 PUR7.2 21.23,97.21 20.22,96.19 20.22,95.1 21.77,93.55 22.2,93.55 C7.1
N$109
  Bottom 0.61: SER10.1 8.56,101.04 | X3.10 8.56,106.35 SER10.1 | SER10.1 8.56,101.09 8.61,101.04 8.43,100.86 8.43,100.03 7.95,99.54 6.22,99.54 5.87,99.19 PUR10.2 5.87,95.23 7.82,93.27 10.18,93.27 10.33,93.12 C10.1
N$111  (via drill 0.6)
  Top 0.61: v12.42,70.89 12.45,70.84 12.45,73.2 | 12.45,73.2 12.45,73.43 | v21.87,95.63 21.84,95.66 21.84,96.8 20.02,98.63 14.1,98.63 12.62,96.7 12.62,92.69 9.02,89.08 9.02,77.01 12.45,73.58 12.45,73.2
  Bottom 0.61: IC1.24 20.04,72.9 18.21,71.07 12.57,71.07 12.39,70.89 | 12.39,70.89 12.37,70.87 | v12.42,70.89 12.39,70.89 | SER7.1 23.52,97.59 23.52,96.7 22.48,95.66 21.87,95.66 v21.87,95.63
SER18  (via drill 0.6)
  Top 0.61: SER18.1 15.44,12.98 15.31,13.11 15.7,13.49 15.7,13.61 14.73,14.58 14.35,14.58 | v12.24,59.16 43,59.16 44.98,61.14 44.98,76.53 42.57,78.94 v37.77,78.94 37.69,78.94 | 14.35,14.58 14.33,14.58 | v14.38,14.6 14.35,14.58
  Bottom 0.61: 12.9,30.56 6.43,30.56 5.82,31.17 5.82,33.45 IN/OUT/OW.2 | v14.38,14.6 15.14,14.6 15.7,15.19 15.7,22.63 12.93,25.4 12.9,30.56 | 37.74,78.82 37.69,78.87 37.74,78.92 | IC1.3 37.67,75.44 37.67,75.46 37.67,78.84 37.74,78.92 | v37.77,78.94 37.74,78.92 | v12.24,59.16 12.17,59.16 12.17,59.21 12.9,59.21 12.9,30.56

### Text on the board
tPlace: 10 | 1 | General I/O Mini REV3 May 2015 Dan Jubenville | R1 | T1 | R2 | T2 | Gnd | 1 | + | - | 1 | + | - | 5V | 18V | 10 | - | + | - | 10
bPlace: 10 | R1 | T1 | R2 | T2 | Gnd | General I/O Mini REV3 May 2015 Dan Jubenville | 1 | - | + | 1 | + | - | 10 | - | + | - | 10
tNames: 5V | GND
bNames: 1 | SERINV | B4 SER | C6 SER | SERSER | To invert serial use | fet, SERINV pad, | SERPUR and SERPDR | non-inv use SERSER